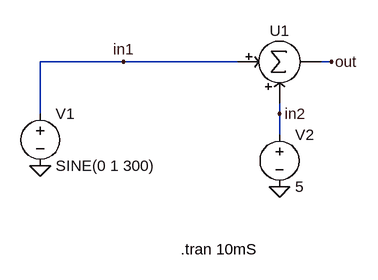
[diagram p0: schematic Draft1.asc]
Draft1.asc, the LTspice schematic file:
Version 4
SHEET 1 880 680
WIRE 128 80 0 80
WIRE 304 80 128 80
WIRE 448 80 432 80
WIRE 0 160 0 80
WIRE 368 160 368 144
WIRE 368 192 368 160
FLAG 0 240 0
FLAG 448 80 out
FLAG 128 80 in1
FLAG 368 272 0
FLAG 368 160 in2
SYMBOL voltage 0 144 R0
WINDOW 123 0 0 Left 0
WINDOW 39 0 0 Left 0
SYMATTR InstName V1
SYMATTR Value SINE(0 1 300)
SYMBOL sum1 368 80 R0
SYMATTR InstName U1
SYMBOL voltage 368 176 R0
WINDOW 123 0 0 Left 0
WINDOW 39 0 0 Left 0
SYMATTR InstName V2
SYMATTR Value 5
TEXT 216 368 Left 2 !.tran 10mS

The netlist it stands for:
* Draft1.asc
V1 in1 0 SINE(0 1 300)
XU1 out in1 in2 sum  ; pins out in1 in2
V2 in2 0 5
.tran 10mS
.lib sum.cir
.backanno
.end